# EasyEDA Pro project 555-timer-CD4017BE.epro

# Schematic Schematic1
Board Name: 555-timer-clock+CD4017BE; Create Date: 2026-03-14; Page Name: 555-timer-CD4017BE; Project Name: Modular-Analog-Synthesizer; Schematic Name: Schematic1; Update Date: 2026-03-19; Company: EasyEDA.com; Page Size: A4; Version: V1.0
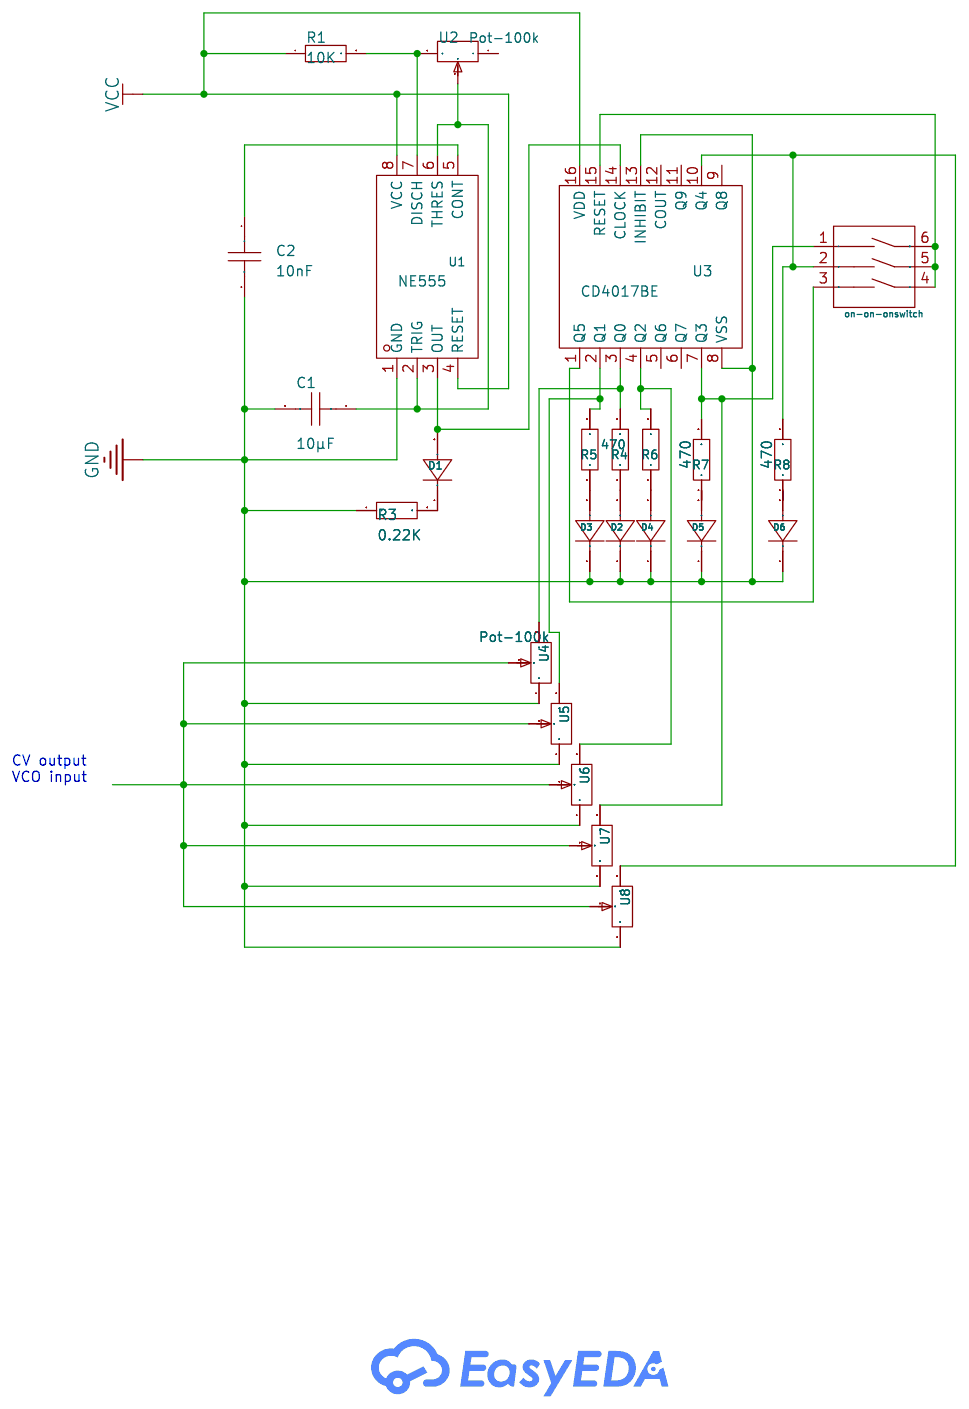
[diagram p0: schematic sheet]

## Parts
C1  10µF  [C0603]
C2  10nF  [C0603]
D1  -  [SMA_L4.4-W2.8-LS5.4-RD]
D2  -  [SMA_L4.4-W2.8-LS5.4-RD]
D3  -  [SMA_L4.4-W2.8-LS5.4-RD]
D4  -  [SMA_L4.4-W2.8-LS5.4-RD]
D5  -  [SMA_L4.4-W2.8-LS5.4-RD]
D6  -  [SMA_L4.4-W2.8-LS5.4-RD]
on-on-onswitch  ATE2D-2M3-10-Z  [SW-TH_ATE2D-2M3-10-Z]
R1  10K  [R0603]
R3  0.22K  [R0603]
R4  470  [R0603]
R5  470  [R0603]
R6  470  [R0603]
R7  470  [R0603]
R8  470  [R0603]
U1  NE555  [SOIC-8_L4.9-W3.9-P1.27-LS6.0-BL]
U2  Pot-100k  [RES-ADJ-SMD_VG039NCH]
U3  CD4017BE  [DIP-16_L19.2-W6.6-P2.54-LS7.6-BL]
U4  Pot-100k  [RES-ADJ-SMD_VG039NCH]
U5  Pot-100k  [RES-ADJ-SMD_VG039NCH]
U6  Pot-100k  [RES-ADJ-SMD_VG039NCH]
U7  Pot-100k  [RES-ADJ-SMD_VG039NCH]
U8  Pot-100k  [RES-ADJ-SMD_VG039NCH]

## Library data of the parts
C1 C2 = CAP_0603: Supplier Footprint: 0603
D1-D6 = 1N4007: Supplier Footprint: SMA(DO-214AC); Supplier Part: C727081
on-on-onswitch = ATE2D-2M3-10-Z: Circuit:DPDT Length:9.5mm Width:5mm Switch Height:18mm Life:50,000 Cycles Current Rating:50mA Voltage Rating (AC):60V Actuator Type:Cylinder Lever Termination Style:Gull Wing Mounting Type:Through Hole Operating Temperature:-20℃~+85℃ Operating Temperature; LCSC Part Name: 拨动开关; Supplier Part: C2921532; Manufacturer: NIDEC(尼得科); Supplier Footprint: 插件,9.5x5mm; JLCPCB Part Class: Extended Part; Datasheet: https://item.szlcsc.com/datasheet/ATE2D-2M3-10-Z/3230384.html; Supplier: LCSC; Circuit: DPDT; Length: 9.5mm; Width: 5mm; Switch Height: 18mm; Life: 50,000 Cycles; Current Rating: 50mA; Voltage Rating (AC): 60V; Actuator Type: Cylinder Lever; Termination Style: Gull Wing; Mounting Type: Through Hole; Operating Temperature: -20℃~+85℃
R1 R3-R8 = Res_0603: Supplier Footprint: 0603
U1 = NE555_C5125085: Supplier Part: C5125085; Manufacturer: IDCHIP(英锐芯); Supplier Footprint: SOP-8; JLCPCB Part Class: Extended Part; Datasheet: https://item.szlcsc.com/datasheet/NE555/5722226.html; Supplier: LCSC
U2 U4-U8 = 3*3Potentiometer-10kΩ20%: Supplier Part: C9900010776; Supplier Footprint: SMD-3P; JLCPCB Part Class: Extended Part; Supplier: LCSC
U3 = CD4017BE: Logic Type:- Direction:- Voltage - Supply:3V~18V Voltage - Supply:3V~18V Trigger Type:Rising Edge Reset:Asynchronous Count Rate:5.5MHz Operating Temperature:-40℃~+85℃ Operating Temperature:-40℃~+85℃ Propagation Delay:85ns; LCSC Part Name: 具有 10 个解码输出的 CMOS 十进制计数器; Supplier Part: C507168; Manufacturer: HGSEMI(华冠); Supplier Footprint: DIP-16; JLCPCB Part Class: Extended Part; Datasheet: https://item.szlcsc.com/datasheet/CD4017BE/520606.html; Supplier: LCSC; Voltage - Supply: 3V~18V; Trigger Type: Rising Edge; Reset: Asynchronous; Count Rate: 5.5MHz; Operating Temperature: -40℃~+85℃; Propagation Delay: 85ns

## Nets
GND: C1.2 C2.2 D2.1(K) D3.1(K) D4.1(K) D5.1(K) D6.1(K) R3.1 U1.1(GND) U3.8(VSS) U3.13(INHIBIT) U4.1 U5.1 U6.1 U7.1 U8.1
VCC: R1.1 U1.4(RESET) U1.8(VCC) U3.16(VDD)
Net-(C1-1): C1.1 U1.2(TRIG) U1.6(THRES) U2.2
Net-(C2-1): C2.1 U1.5(CONT)
Net-(D1-1): D1.1(K) R3.2
Net-(D1-2): D1.2(A) U1.3(OUT) U3.14(CLOCK)
Net-(D2-2): D2.2(A) R4.1
Net-(D3-2): D3.2(A) R5.1
Net-(D4-2): D4.2(A) R6.1
Net-(D5-2): D5.2(A) R7.1
Net-(D6-2): D6.2(A) R8.1
Net-(on-on-onswitch-1): on-on-onswitch.1 R7.2 U3.7(Q3) U7.3
Net-(on-on-onswitch-2): on-on-onswitch.2 R8.2 U3.10(Q4) U8.3
Net-(on-on-onswitch-3): on-on-onswitch.3 U3.1(Q5)
Net-(on-on-onswitch-4): on-on-onswitch.4 on-on-onswitch.5 on-on-onswitch.6 U3.15(RESET)
Net-(R1-2): R1.2 U1.7(DISCH) U2.3
Net-(R4-2): R4.2 U3.3(Q0) U4.3
Net-(R5-2): R5.2 U3.2(Q1) U5.3
Net-(R6-2): R6.2 U3.4(Q2) U6.3
Net-(U4-2): U4.2 U5.2 U6.2 U7.2 U8.2

Not connected (* = marked no-connect by the designer): U2 1; U3 5(Q6) 6(Q7) 9(Q8) 11(Q9) 12(COUT)

## Notes on the sheet
- CV output
  VCO input
